# Altium project Project_OpenCarTracker.PrjPcb
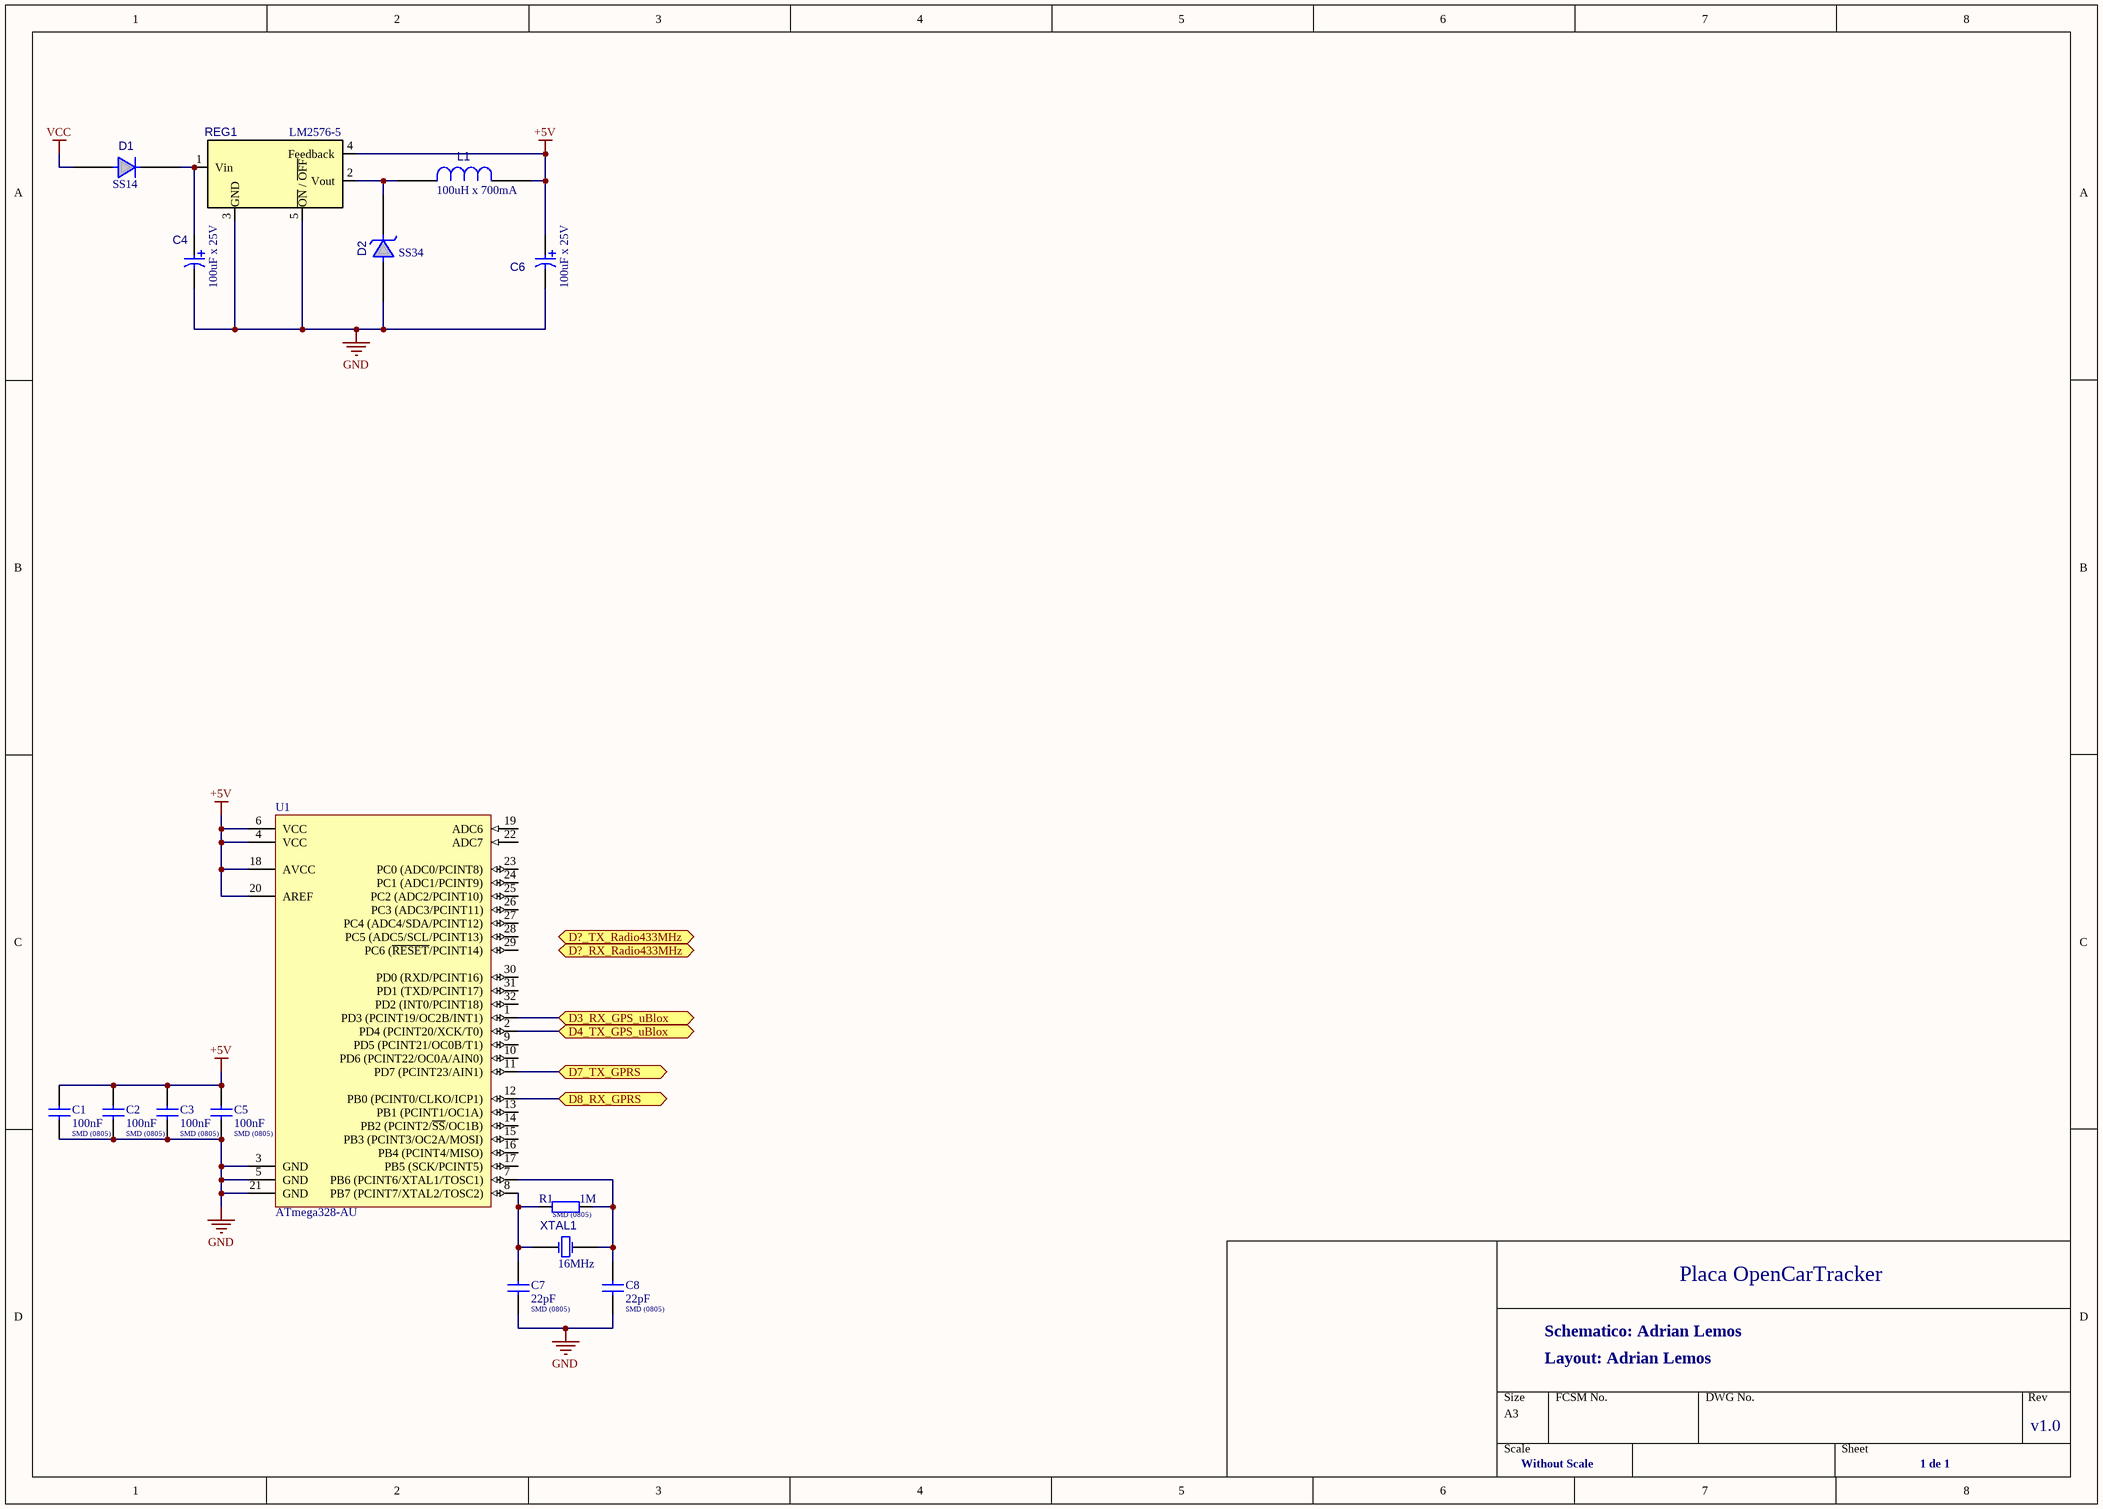
[diagram p0: Sch_.SchDoc]
1 sheet, 15 parts. Net scope: flat (ports and power ports of the same name join across sheets).
Board files: Pcb_OpenCarTracker_v1.0.PcbDoc, Panel_OpenCarTracker_V1.0.PcbDoc

## Sheet Sch_.SchDoc
size A3

### Parts
C1  Valor: 100nF  Encapsulamento: SMD (0805)  [CAP_0805]  (hidden comment: Capacitor SMD)
C2  Valor: 100nF  Encapsulamento: SMD (0805)  [CAP_0805]  (hidden comment: Capacitor SMD)
C3  Valor: 100nF  Encapsulamento: SMD (0805)  [CAP_0805]  (hidden comment: Capacitor SMD)
C4  Valor: 100uF x 25V  [CAPACITOR ELETROLITICO SMD]  (hidden comment: Capacitor Eletrolitico)
C5  Valor: 100nF  Encapsulamento: SMD (0805)  [CAP_0805]  (hidden comment: Capacitor SMD)
C6  Valor: 100uF x 25V  [CAPACITOR ELETROLITICO SMD]  (hidden comment: Capacitor Eletrolitico)
C7  Valor: 22pF  Encapsulamento: SMD (0805)  [CAP_0805]  (hidden comment: Capacitor SMD)
C8  Valor: 22pF  Encapsulamento: SMD (0805)  [CAP_0805]  (hidden comment: Capacitor SMD)
D1  Modelo: SS14  [DO214AC]  (hidden comment: DIODO_SS14_S1D)
D2  SS34  [DO214AB]
L1  Valor: 100uH x 700mA  [INDUTOR RADIAL 10.5MM]  (hidden comment: Indutor_700mA)
R1  Valor: 1M  Encapsulamento: SMD (0805)  [RES_0805]  (hidden comment: Resistor SMD)
REG1  Modelo: LM2576-5  [TO-263-5]  (hidden comment: LM2576)
U1  ATmega328-AU  [TQFP32]
XTAL1  Valor: 16MHz  [Cristal HC49S]  (hidden comment: CRISTAL-SMD-HC49S)

### Ports
D3_RX_GPS_uBlox, D4_TX_GPS_uBlox, D7_TX_GPRS, D8_RX_GPRS, D?_RX_Radio433MHz, D?_TX_Radio433MHz

### Nets
+5V: C1.2 C2.2 C3.2 C5.2 C6.1(PLUS) L1.1 REG1.4(Feedback) U1.4(VCC) U1.6(VCC) U1.18(AVCC) U1.20(AREF)
GND: C1.1 C2.1 C3.1 C4.2(MINUS) C5.1 C6.2(MINUS) C7.1 C8.1 D2.1 REG1.3(GND) REG1.5(~{ON}_/_~{OFF}) U1.3(GND) U1.5(GND) U1.21(GND)
VCC: D1.2(A)
NetC4_1: C4.1(PLUS) D1.1(K) REG1.1(Vin)
NetC7_2: C7.2 R1.1 U1.8(PB7_(PCINT7/XTAL2/TOSC2)) XTAL1.1(OSC1)
NetC8_2: C8.2 R1.2 U1.7(PB6_(PCINT6/XTAL1/TOSC1)) XTAL1.2(OSC2)
NetD2_2: D2.2 L1.2 REG1.2(Vout)
NetU1_1: U1.1(PD3_(PCINT19/OC2B/INT1)) ; port D3_RX_GPS_uBlox
NetU1_2: U1.2(PD4_(PCINT20/XCK/T0)) ; port D4_TX_GPS_uBlox
NetU1_11: U1.11(PD7_(PCINT23/AIN1)) ; port D7_TX_GPRS
NetU1_12: U1.12(PB0_(PCINT0/CLKO/ICP1)) ; port D8_RX_GPRS

Not connected (* = marked no-connect by the designer): U1 9(PD5_(PCINT21/OC0B/T1)) 10(PD6_(PCINT22/OC0A/AIN0)) 13(PB1_(PCINT1/OC1A)) 14(PB2_(PCINT2/~{SS}/OC1B)) 15(PB3_(PCINT3/OC2A/MOSI)) 16(PB4_(PCINT4/MISO)) 17(PB5_(SCK/PCINT5)) 19(ADC6) 22(ADC7) 23(PC0_(ADC0/PCINT8)) 24(PC1_(ADC1/PCINT9)) 25(PC2_(ADC2/PCINT10)) 26(PC3_(ADC3/PCINT11)) 27(PC4_(ADC4/SDA/PCINT12)) 28(PC5_(ADC5/SCL/PCINT13)) 29(PC6_(~{RESET}/PCINT14)) 30(PD0_(RXD/PCINT16)) 31(PD1_(TXD/PCINT17)) 32(PD2_(INT0/PCINT18))

### Notes on the sheet
- Placa OpenCarTracker
- Schematico: Adrian Lemos
- Layout: Adrian Lemos
- Without Scale
- 1 de 1
- v1.0

### Library data of the parts
C4 C6 = Capacitor Eletrolitico: Descrição: Capacitor Eletrolitico PTH; Encapsulamento: PTH Radia Xmm x Ymm; Marca: *; Modelo: *; Observação: *
D1 = SS14 Schottky Diode: Diodo SMD Shottky; Descrição: Diodo Schottky Retificador; Encapsulamento: SMD (DO-214AC); Marca: Vishay; Observação: *
D2 = SS34: DIODO-SCHOTTKY-SMD 3A 40V; Descrição: Diodo Schottky 3A 40V; Encapsulamento: SMD - DO214AB; Valor: *; Marca: *; Observação: *; Modelo: SS34
L1 = Indutor_700mA: IND200-CIRC; Descrição: Indutor Carretel PTH; Encapsulamento: PTH - Radial; Marca: *; Modelo: *; Observação: *
R1 = Resistor SMD: Descrição: Resistor SMD 5%; Marca: *; Modelo: *; Observação: *
REG1 = LM2576: Regulador de Tensão LM2576; Encapsulamento: SMD SOT-263-5; Descrição: Regulador de Tensão; Valor: *; Marca: *; Observação: *
U1 = ATmega328-AU: 8-bit AVR Microcontroller, 32KB Flash, 1KB EEPROM, 2KB SRAM, 32-pin TQFP, Industrial Grade (-40°C to 85°C); Descrição: Microcontrolador 8 Bits; Encapsulamento: SMD 32A; Marca: Atmel; Valor: *; Observação: *; Modelo: ATmega328-AU
XTAL1 = CRISTAL-SMD-HC49S: Descrição: Cristal Oscilador; Encapsulamento: SMD HC49S; Marca: *; Modelo: *; Observação: *
C1-C3 C5 C7 C8 = Capacitor SMD: Descrição: Capacitor SMD; Marca: *; Modelo: *; Observação: *